# EAGLE schematic fuzzface (EAGLE 9.6.2)
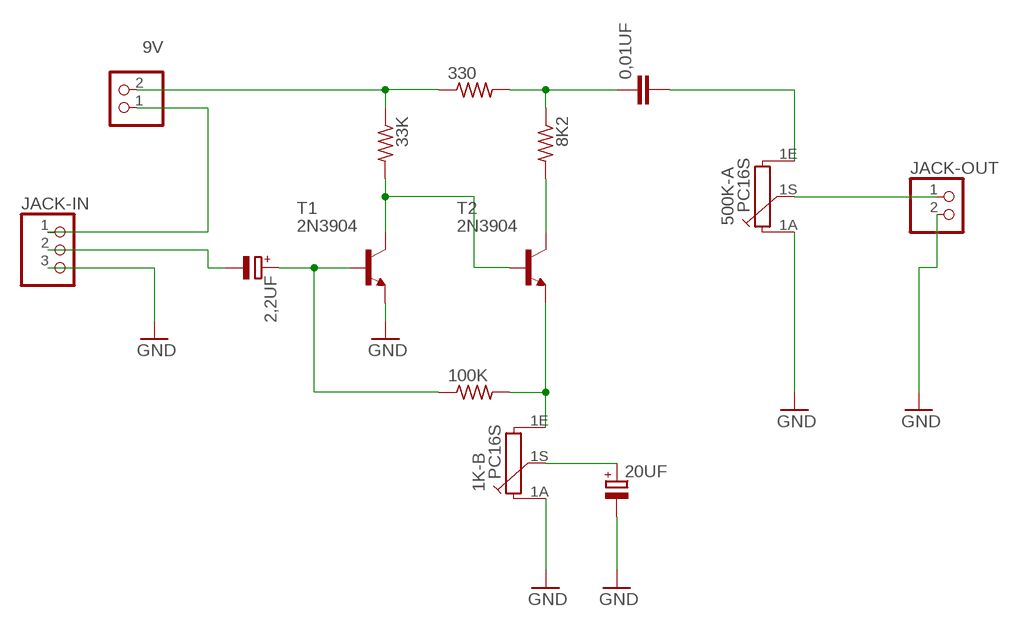
[diagram p0: schematic, sheet 1]

## Parts
0,01UF  C2,5-3  [C2.5-3]
1K-B  PC16S  [PC16S]
2,2UF  CPOL-EUE1.8-4  [E1,8-4]
8K2  R-US_0204/7  [0204/7]
9V  PINHD-1X2  [1X02]
20UF  CPOL-EUE1.8-4  [E1,8-4]
33K  R-US_0204/7  [0204/7]
100K  R-US_0204/7  [0204/7]
330  R-US_0204/7  [0204/7]
500K-A  PC16S  [PC16S]
JACK-IN  PINHD-1X3  [1X03]
JACK-OUT  PINHD-1X2  [1X02]
T1  2N3904  [TO92]
T2  2N3904  [TO92]

## Nets
GND: 1K-B.1A 20UF.- 500K-A.1A JACK-IN.3 JACK-OUT.2 T1.3(E)
N$1: 9V.2 33K.1 330.1
N$2: 0,01UF.1 8K2.1 330.2
N$3: 0,01UF.2 500K-A.1E
N$4: 8K2.2 T2.1(C)
N$5: 33K.2 T1.1(C) T2.2(B)
N$6: 1K-B.1E 100K.2 T2.3(E)
N$7: 1K-B.1S 20UF.+
N$8: 2,2UF.+ 100K.1 T1.2(B)
N$9: 500K-A.1S JACK-OUT.1
N$11: 9V.1 JACK-IN.1
N$12: 2,2UF.- JACK-IN.2

## Library data of the parts
0,01UF = capacitor-wima:C: CAPACITOR naming: grid - package width
1K-B 500K-A = piher:PC16S: POTENTIOMETER single carbon potentiometer, 16 mm, S3ROH; OC_FARNELL: 4452940; OC_NEWARK: unknown
2,2UF 20UF = rcl:CPOL-EU: POLARIZED CAPACITOR, European symbol; SPICEPREFIX: C
8K2 33K 100K 330 = rcl:R-US_: RESISTOR, American symbol; SPICEPREFIX: R
9V JACK-OUT = pinhead:PINHD-1X2: PIN HEADER
JACK-IN = pinhead:PINHD-1X3: PIN HEADER
T1 T2 = transistor:2N3904: NPN TRANSISTOR